# EAGLE design StarFire (EAGLE 7.5.0)
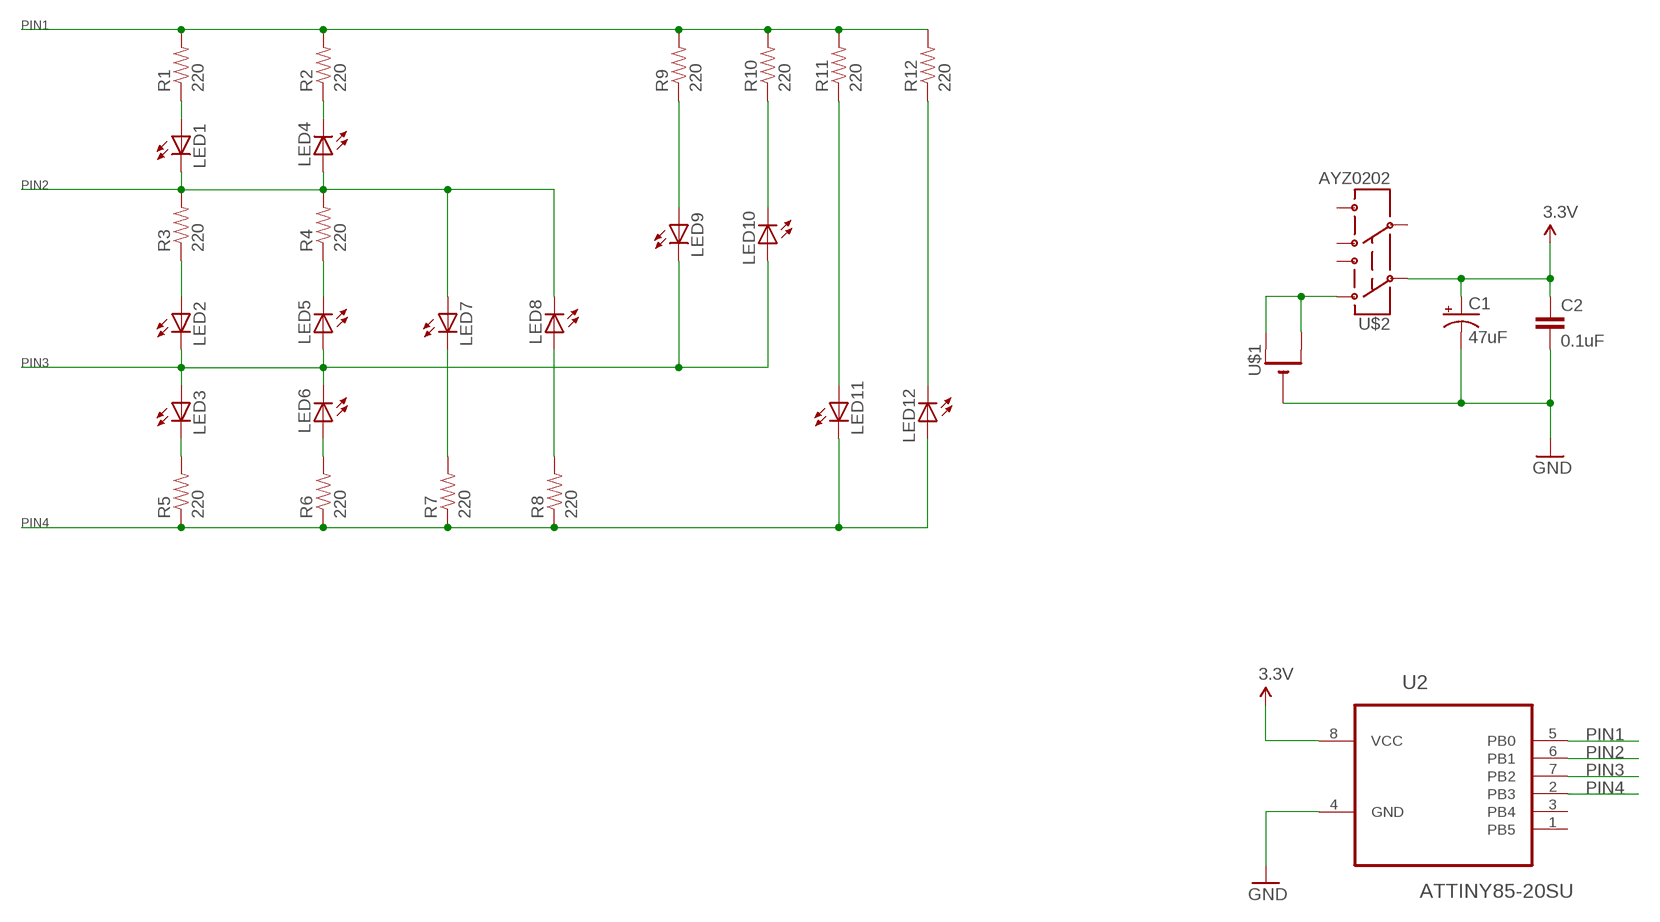
[diagram p0: schematic, sheet 1]

## Parts
C1  47uF  47UF-10V-10%(TANT)  [EIA3528]
C2  0.1uF  0.1UF-25V(+80/-20%)(0603)  [0603-CAP]
LED1  LEDCHIP-LED0603  [CHIP-LED0603]
LED2  LEDCHIP-LED0603  [CHIP-LED0603]
LED3  LEDCHIP-LED0603  [CHIP-LED0603]
LED4  LEDCHIP-LED0603  [CHIP-LED0603]
LED5  LEDCHIP-LED0603  [CHIP-LED0603]
LED6  LEDCHIP-LED0603  [CHIP-LED0603]
LED7  LEDCHIP-LED0603  [CHIP-LED0603]
LED8  LEDCHIP-LED0603  [CHIP-LED0603]
LED9  LEDCHIP-LED0603  [CHIP-LED0603]
LED10  LEDCHIP-LED0603  [CHIP-LED0603]
LED11  LEDCHIP-LED0603  [CHIP-LED0603]
LED12  LEDCHIP-LED0603  [CHIP-LED0603]
R1  220  RESISTOR0402-RES  [0402-RES]
R2  220  RESISTOR0402-RES  [0402-RES]
R3  220  RESISTOR0402-RES  [0402-RES]
R4  220  RESISTOR0402-RES  [0402-RES]
R5  220  RESISTOR0402-RES  [0402-RES]
R6  220  RESISTOR0402-RES  [0402-RES]
R7  220  RESISTOR0402-RES  [0402-RES]
R8  220  RESISTOR0402-RES  [0402-RES]
R9  220  RESISTOR0402-RES  [0402-RES]
R10  220  RESISTOR0402-RES  [0402-RES]
R11  220  RESISTOR0402-RES  [0402-RES]
R12  220  RESISTOR0402-RES  [0402-RES]
U2  ATTINY85-20SU  [SOIC127P798X216-8N]
U$1  CR1220SMT  [CR1220-SMD]
U$2  AYZ0202  [AYZ0202]

## Nets
3.3V: C1.A(+) C2.1 U2.8(VCC) U$2.2
GND: C1.C(-) C2.2 U2.4(GND) U$1.-
N$1: LED1.A R1.1
N$2: LED4.C R2.1
N$3: LED2.A R3.1
N$4: LED5.C R4.1
N$5: LED3.C R5.2
N$6: LED6.A R6.2
N$7: LED7.C R7.2
N$8: LED8.A R8.2
N$9: LED9.A R9.1
N$10: LED10.C R10.1
N$11: LED11.A R11.1
N$12: LED12.C R12.1
N$13: U$1.+$1(+) U$2.3
PIN1: R1.2 R2.2 R9.2 R10.2 R11.2 R12.2 U2.5(PB0)
PIN2: LED1.C LED4.A LED7.A LED8.C R3.2 R4.2 U2.6(PB1)
PIN3: LED2.C LED3.A LED5.A LED6.C LED9.C LED10.A U2.7(PB2)
PIN4: LED11.C LED12.A R5.1 R6.1 R7.1 R8.1 U2.2(PB3)
Unconnected: U2.1(PB5) U2.3(PB4) U$1.+$2(+1) U$2.1 U$2.4 U$2.5 U$2.6

## Library data of the parts
C1 = SparkFun-Capacitors:47UF-10V-10%(TANT): CAP-08310 47uF Tantalum SMT 10V 10% (EIA-3528); PROD_ID: CAP-08310
C2 = SparkFun-Capacitors:0.1UF-25V(+80/-20%)(0603): CAP-00810 Ceramic Standard decoupling cap; PROD_ID: CAP-00810
LED1-LED12 = adafruit:LED: LED OSRAM: - CHIPLED LG R971, LG N971, LY N971, LG Q971, LY Q971, LO R971, LY R971 LH N974, LH R974 LS Q976, LO Q976, LY Q976 LO Q996 - Hyper CHIPLED LW Q18S LB Q993, LB Q99A, LB R99A - SideLED LS A670, LO A670, LY A670, LG A670, LP A670 LB A673, LV A673, LT A673, LW A673 LH A674 LY A675 LS A676, LA A676, LO A676, LY A676, LW A676 LS A679, LY A679, LG A679 - Hyper Micro SIDELED® LS Y876, LA Y876, LO Y876, LY Y876 LT Y87S - SmartLED LW L88C, LW L88S LB L89C, LB L89S, LG L890 LS L89K, LO L89K, LY L89K LS L896, LA L896, LO L896, LY L896 - TOPLED LS T670, LO T670, LY T670, LG T670, LP T670 LSG T670, LSP T670, LSY T670, LOP T670, LYG T670 LG T671, LOG T671, LSG T671 LB T673, LV T673, LT T673, LW T673 LH T674 LS T676, LA T676, LO T676, LY T676, LB T676, LH T676, LSB T676, LW T676 LB T67C, LV T67C, LT T67C, LS T67K, LO T67K, LY T67K, LW E67C LS E67B, LA E67B, LO E67B, LY E67B, LB E67C, LV E67C, LT E67C LW T67C LS T679, LY T679, LG T679 LS T770, LO T770, LY T770, LG T770, LP T770 LB T773, LV T773, LT T773, LW T773 LH T774 LS E675, LA E675, LY E675, LS T675 LS T776, LA T776, LO T776, LY T776, LB T776 LHGB T686 LT T68C, LB T68C - Hyper Mini TOPLED® LB M676 - Mini TOPLED Santana® LG M470 LS M47K, LO M47K, LY M47K Source: http://www.osram.convergy.de/
R1-R12 = SparkFun-Passives:RESISTOR: Resistor Basic schematic elements and footprints for 0603, 1206, and PTH resistors.
U2 = Atmel:ATTINY85-20SU: 8-bit Microcontroller with In-System Programmable Flash; MPN: ATTINY85-20SU; OC_FARNELL: 1455164; OC_NEWARK: 58M3797; PACKAGE: SOIC-8; SUPPLIER: Atmel
U$1 = adafruit:CR1220: CR1216/CR1220/CR1225 12mm 3V lithium coin cell Great for battery packup. Both SMT and THM holders. Note the THM package has the ground pads on both sides of the PCB so that the masks are the same - this reduces the cost
U$2 = SparkFun-Electromechanical:AYZ0202: SPDT Slide Switch Simple SMD single-pull double-throw slide switch. Good for less than 350mA power switch, switching UARTs between devices, etc. Spark Fun Electronics SKU : COM-00597

## Board
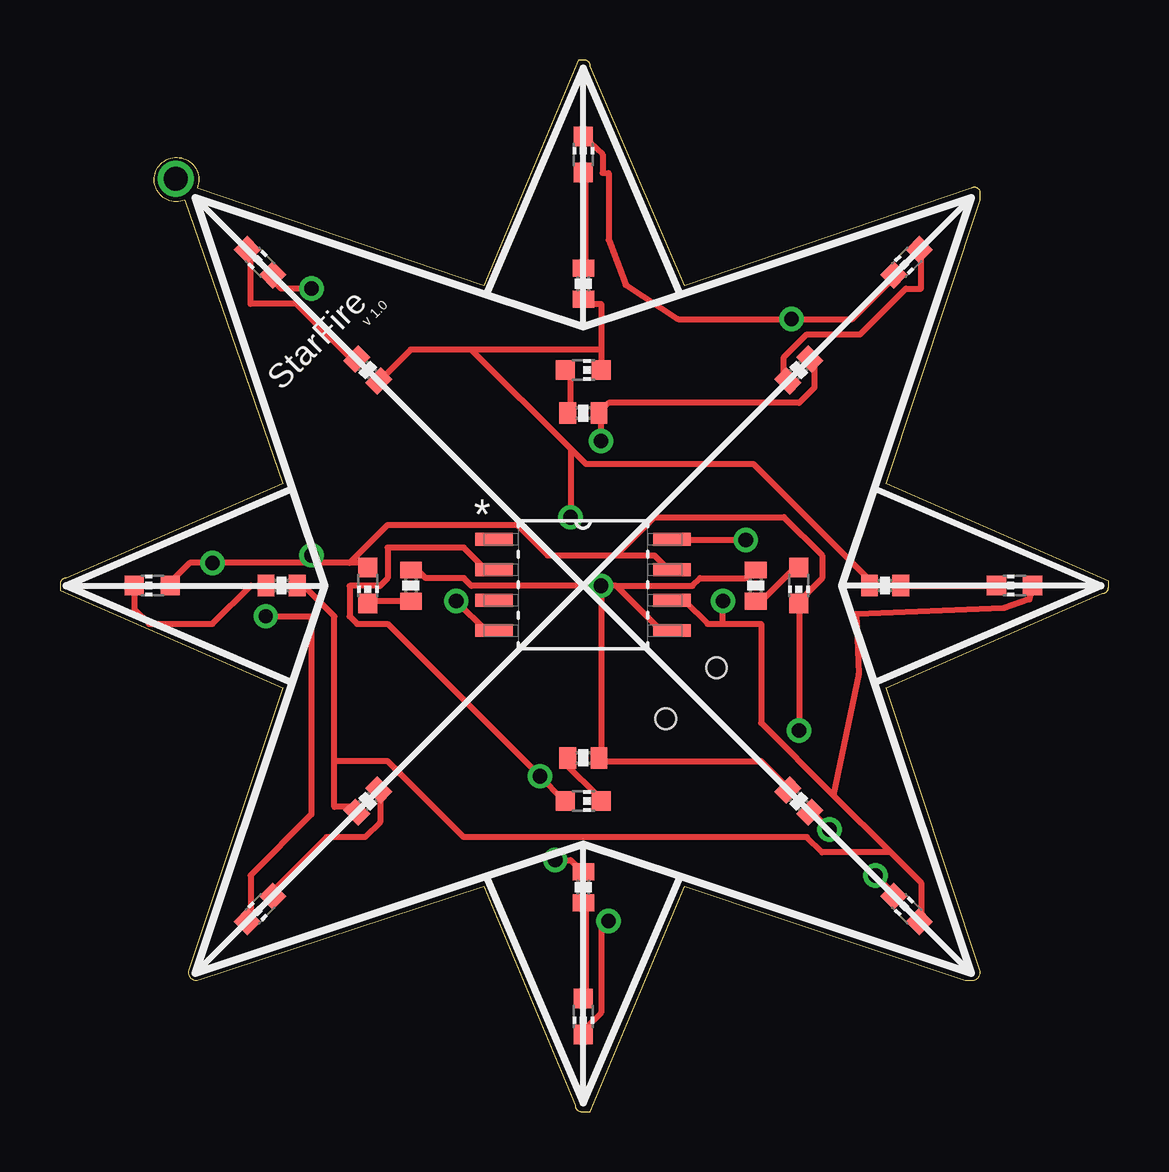
[diagram p1: board, top side]
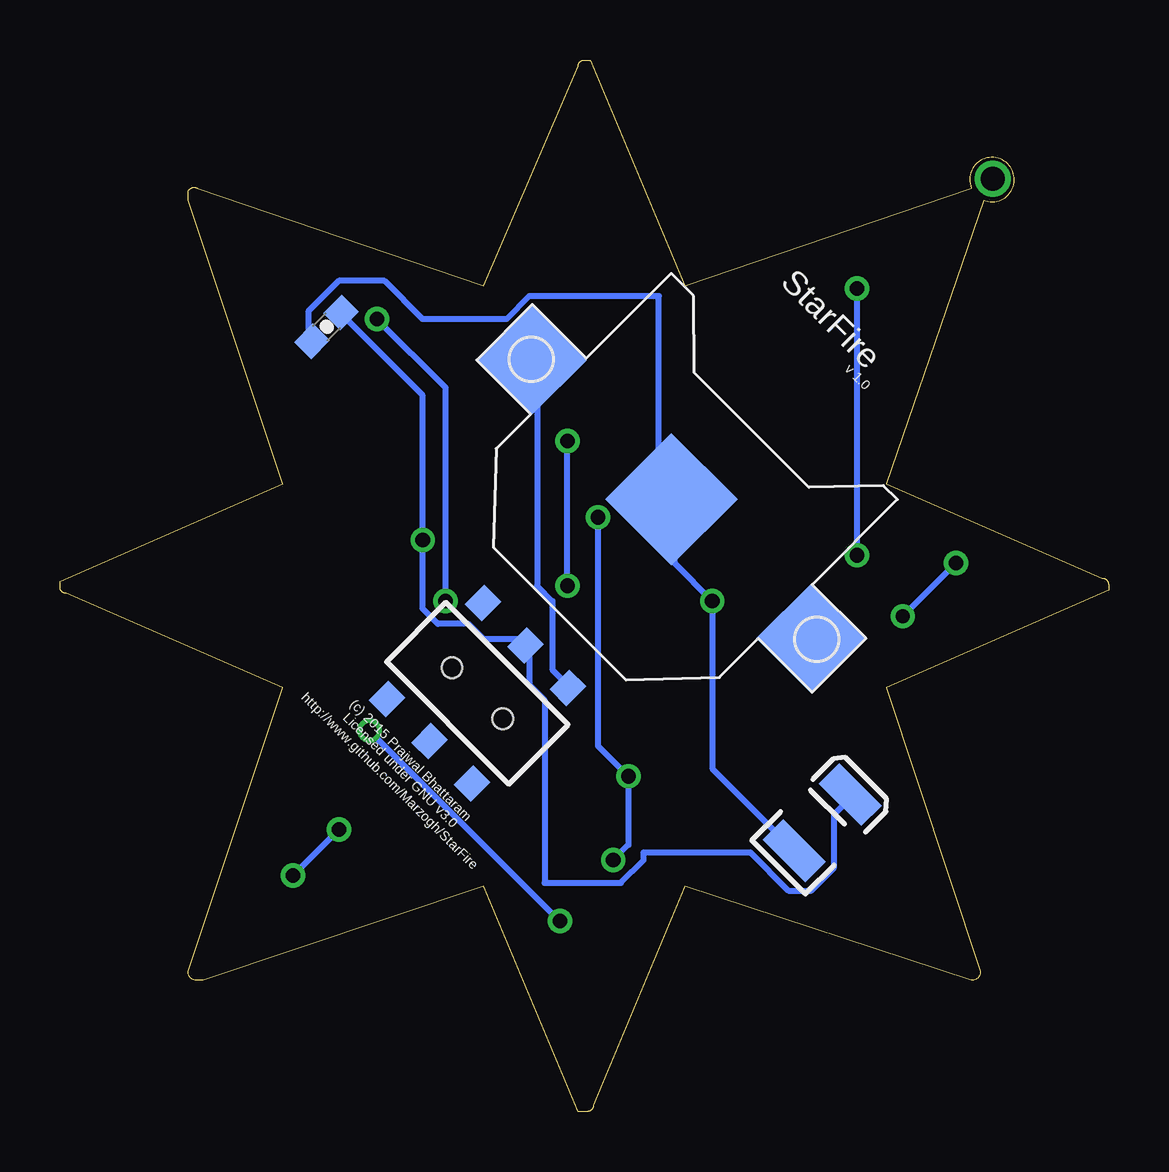
[diagram p2: board, bottom side, seen from below]

Size 43.69 x 43.81 mm. Coordinates in mm from the lower left corner, seen from the top.
Outline: 5.21,37.97 9.27,26.16 0.25,22.23 arc90 0,21.97 0,21.72 9.27,17.65 5.33,5.84 arc90 5.71,5.46 17.65,9.4 21.46,0.25 arc90 21.72,0 22.1,0 26.04,9.4 37.72,5.46 37.97,5.46 arc90 38.35,5.84 34.42,17.65 43.43,21.59 arc90 43.69,21.84 43.69,22.1 34.42,26.16 38.35,37.97 38.35,38.35 arc90 37.97,38.48 26.04,34.42 22.1,43.56 arc90 21.84,43.81 21.59,43.81 17.65,34.42 5.71,38.48 arc314 5.21,37.97
Copper layers (1*16): Top 0.035mm / dielectric 1.5mm / Bottom 0.035mm
Design rules "default": minimum track width 10mil, minimum drill 24mil, track to track 8mil, track to pad 8mil, pad to pad 8mil, via to via 8mil, smd to smd 8mil, copper to edge 40mil, drill to drill 8mil, minimum pad ring 10mil, minimum via ring 8mil, stop-mask expansion 4mil, vias tented up to drill 0mil, thermal gap 10mil

### Footprints (pad centres in the part's own frame; a part is rotated, then mirrored left to right if it is on the bottom)
EIA3528 = smd 1.2 x 2.5: A 1.65,0; C -1.65,0
0603-CAP = smd 1.1 x 1: 1 -0.85,0; 2 0.85,0
CHIP-LED0603 = smd 0.8 x 0.8: A 0,-0.75; C 0,0.75
0402-RES = smd 0.7 x 0.9: 1 -0.65,0; 2 0.65,0
SOIC127P798X216-8N = smd 1.549 x 0.533: 1 -3.708,1.905; 2 -3.708,0.635; 3 -3.708,-0.635; 4 -3.708,-1.905; 5 3.708,-1.905; 6 3.708,-0.635; 7 3.708,0.635; 8 3.708,1.905
CR1220-SMD = smd 3.2 x 3.2: +$1 -8.2,0; +$2 8.2,0 | smd 3.9 x 3.9: - 0,0
AYZ0202 = smd 1 x 1.15: 1 -2.5,2.825; 2 0,2.825; 3 2.5,2.825; 4 -2.5,-2.825; 5 0,-2.825; 6 2.5,-2.825 | hole 0.85: 1.5,0; -1.5,0

### Placement (x,y rotation side)
C1  11.93,12.04 45 bottom
C2  32.58,32.69 225 bottom
LED1  35.28,35.39 135 top
LED2  8.34,8.45 135 top
LED3  8.34,35.39 45 top
LED4  35.28,8.45 45 top
LED5  3.85,21.92 90 top
LED6  21.81,3.96 180 top
LED7  39.77,21.92 90 top
LED8  21.81,39.88 0 top
LED9  30.79,21.92 180 top
LED10  12.83,21.92 180 top
LED11  21.81,30.9 270 top
LED12  21.81,12.94 270 top
R1  30.79,30.9 45 top
R2  30.79,12.94 135 top
R3  12.83,12.94 225 top
R4  9.23,21.92 0 top
R5  12.83,30.9 135 top
R6  21.81,9.35 270 top
R7  34.38,21.92 0 top
R8  21.81,34.49 90 top
R9  28.99,21.92 90 top
R10  14.62,21.92 90 top
R11  21.81,29.1 0 top
R12  21.81,14.73 0 top
U2  21.79,21.95 0 top
U$1  18.21,25.51 315 bottom
U$2  26.3,17.43 315 bottom

### Tracks (layer width: path | path; a pad name or v marks a point on that pad's centre or on a via)
3.3V  (via drill 0.61)
  Top 0.254: v28.57,23.81 25.72,23.81 U2.8
  Bottom 0.254: C2.1 31.75,33.02 28.57,29.84 v28.57,23.81 28.57,20.95 27.94,20.32 26.67,20.32 26.04,19.68 24.45,19.68 U$2.2 24.13,19.37 24.13,17.78 23.5,17.14 23.5,9.53 20.32,9.53 19.37,10.48 19.37,10.79 14.92,10.79 13.34,9.21 12.38,9.21 11.43,10.16 11.43,12.38 10.79,13.02 C1.A
GND  (via drill 0.61)
  Top 0.254: v16.51,21.27 17.78,20 U2.4
  Bottom 0.254: C2.2 33.34,32.38 33.34,33.34 32.07,34.61 30.16,34.61 28.57,33.02 25.08,33.02 24.13,33.97 18.73,33.97 18.73,26.04 18.41,25.72 U$1.- 18.1,25.4 18.1,22.86 v16.51,21.27 16.51,14.29 13.34,11.11 C1.C
N$1
  Top 0.254: LED1.A 35.88,35.88 35.88,34.29 35.24,34.29 33.34,32.38 31.11,32.38 30.16,31.43 30.16,30.48 R1.1
N$2  (via drill 0.61)
  Top 0.254: v33.97,9.84 34.61,9.21 LED4.C | v32.07,11.75 31.43,12.38 R2.1
  Bottom 0.254: v32.07,11.75 v33.97,9.84
N$3
  Top 0.254: LED2.A 8.89,9.21 11.11,11.43 12.7,11.43 13.34,12.06 13.34,13.34 R3.1
N$4
  Top 0.254: LED5.C 3.1,20.93 3.71,20.32 6.35,20.32 7.95,21.92 R4.1
N$5
  Top 0.254: LED3.C 7.94,35.88 7.94,33.66 9.84,33.66 12.06,31.43 R5.2
N$6
  Top 0.254: LED6.A 21.91,4.76 21.91,8.57 R6.2
N$7
  Top 0.254: LED7.C 38.73,21.91 35.24,21.91 R7.2
N$8
  Top 0.254: LED8.A 21.91,39.05 21.91,35.24 R8.2
N$9
  Top 0.254: LED9.A 30.48,22.54 29.21,21.27 R9.1
N$10
  Top 0.254: LED10.C 13.02,21.27 14.61,21.27 R10.1
N$11
  Top 0.254: LED11.A 21.27,30.8 21.27,29.21 R11.1
N$12
  Top 0.254: LED12.C 22.54,13.02 20.95,14.61 R12.1
N$13
  Bottom 0.254: U$2.3 22.54,17.78 23.18,18.41 23.18,21.27 23.81,21.91 23.81,31.11 U$1.+$1
N$14  (via drill 1)
  other vias: 4.83,38.86
PIN1  (via drill 0.61)
  Top 0.254: R1.2 31.43,31.11 31.43,30.16 30.8,29.53 22.86,29.53 22.54,29.21 R11.2 22.54,28.89 v22.54,27.94 | 23.18,21.91 v22.54,21.91 | v22.54,21.91 17.14,21.91 16.83,22.23 15.24,22.23 14.92,22.54 R10.2 | 23.18,21.91 25.08,20 25.4,20 U2.5 | v22.54,21.91 22.54,14.92 R12.2 22.54,14.61 29.21,14.61 30.16,13.65 R2.2 | 23.18,21.91 26.35,21.91 26.67,22.23 28.57,22.23 28.89,22.54 R9.2
  Bottom 0.254: v22.54,21.91 v22.54,27.94
PIN2  (via drill 0.61)
  Top 0.254: 11.43,14.61 11.43,12.7 12.06,12.7 R3.2 | 11.43,14.61 11.43,20.64 10.16,21.91 R4.2 | 32.23,13.18 29.21,16.19 29.21,20.32 27.62,20.32 | 32.23,13.18 34.61,10.79 | 34.61,10.79 35.88,9.53 35.88,7.94 LED4.A | 27.62,20.32 26.99,20.32 26.04,21.27 25.72,21.27 U2.6 | 27.62,20.32 v27.62,21.27 | LED1.C 34.61,34.61 33.02,33.02 v30.48,33.02 25.76,33.02 23.57,34.44 22.86,36.32 22.86,39.1 22.61,39.12 22.61,39.88 LED8.C | 11.43,14.61 13.65,14.61 16.83,11.43 31.11,11.43 31.75,10.79 34.61,10.79 | 32.23,13.18 33.27,18.24 33.17,20.73 39.33,20.98 40.39,21.34 LED7.A
  Bottom 0.254: v30.48,33.02 27.62,30.16 v27.62,21.27
PIN3  (via drill 0.6 pad 1.02, 0.61)
  Top 0.254: v22.86,7.94 22.54,7.94 22.54,4.13 21.91,3.49 LED6.C | v30.8,15.88 30.8,20.95 LED9.C 30.8,21.27 31.75,22.23 31.75,23.18 30.16,24.77 24.77,24.77 23.18,23.18 | 12.06,22.86 12.7,22.86 LED10.A | 12.06,22.86 10.48,22.86 | 10.48,22.86 v6.35,22.86 5.4,22.86 4.76,22.23 LED5.A | v8.57,20.64 10.48,20.64 10.48,12.38 7.94,9.84 7.94,7.94 LED2.C | v10.48,34.29 9.21,34.29 8.89,34.61 LED3.A | 10.48,22.86 v10.48,23.18 | 23.18,23.18 20.32,23.18 19.05,24.45 13.65,24.45 12.06,22.86 | 23.18,23.18 24.77,23.18 25.4,22.54 U2.7
  Bottom 0.254: v30.8,15.88 v22.86,7.94 | v6.35,22.86 v8.57,20.64 | v10.48,23.18 v10.48,34.29
PIN4  (via drill 0.61)
  Top 0.254: LED12.A 20.95,13.02 v20,13.97 13.65,20.32 12.38,20.32 12.06,20.64 12.06,21.91 13.34,21.91 13.65,22.23 13.65,23.5 16.83,23.5 17.78,22.54 U2.2 | v20.64,10.48 21.27,10.48 21.59,10.16 R6.1 | 22.54,31.75 22.54,33.66 21.91,33.66 R8.1 | 22.54,31.75 22.54,31.11 LED11.C | 22.54,31.75 17.14,31.75 | 17.14,31.75 14.61,31.75 13.34,30.48 R5.1 | 17.14,31.75 21.27,27.62 | 21.27,27.62 21.91,26.99 28.89,26.99 33.66,22.23 R7.1 | 21.27,27.62 v21.27,24.77
  Bottom 0.254: v20.64,10.48 20,11.11 v20,13.97 21.27,15.24 v21.27,24.77

### Text on the board
_tsilk: v 1.0 | StarFire
_bsilk: StarFire | v 1.0 | (c) 2015 Prajwal Bhattaram / Licensed under GNU v3.0 / http://www.github.com/Marzogh/StarFire